# Altium schematic sheet Sheet2.SchDoc
size A4
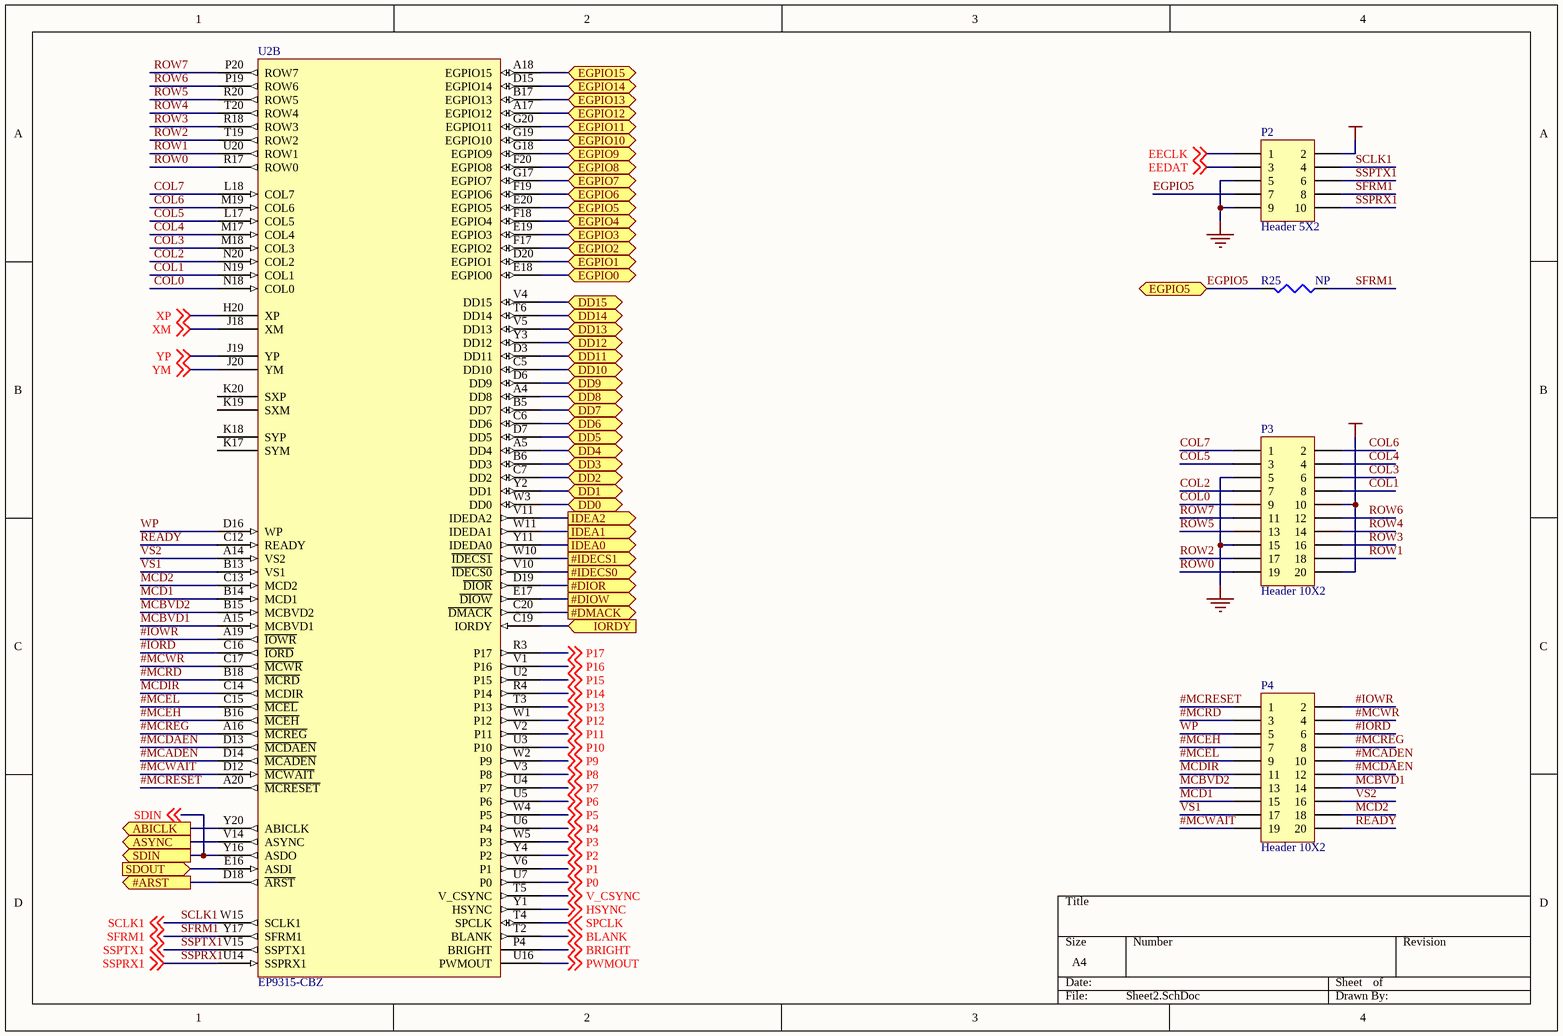
[diagram p0: Sheet2.SchDoc]

## Parts
P2  Header 5X2  [HDR2X5]
P3  Header 10X2  [HDR2X10]
P4  Header 10X2  [HDR2X10]
R25  NP  [CR1608-0603]
U2  EP9315-CBZ  [BGA352x20]  (part B of 4)

## Ports
#ARST (out), #DIOR (out), #DIOW (out), #DMACK (out), #IDECS0 (out), #IDECS1 (out), ABICLK (out), ASYNC (out), DD0 (bidir), DD1 (bidir), DD2 (bidir), DD3 (bidir), DD4 (bidir), DD5 (bidir), DD6 (bidir), DD7 (bidir), DD8 (bidir), DD9 (bidir), DD10 (bidir), DD11 (bidir), DD12 (bidir), DD13 (bidir), DD14 (bidir), DD15 (bidir), EGPIO0 (bidir), EGPIO1 (bidir), EGPIO2 (bidir), EGPIO3 (bidir), EGPIO4 (bidir), EGPIO5 (bidir), EGPIO6 (bidir), EGPIO7 (bidir), EGPIO8 (bidir), EGPIO9 (bidir), EGPIO10 (bidir), EGPIO11 (bidir), EGPIO12 (bidir), EGPIO13 (bidir), EGPIO14 (bidir), EGPIO15 (bidir), IDEA0 (out), IDEA1 (out), IDEA2 (out), IORDY (in), SDIN (out), SDOUT (in)

## Nets
GND: P2.5 P2.9 P3.5 P3.15
VCCIO: P2.2 P3.10 P3.20
#ARST: U2.D18(~{ARST}) ; port #ARST
#DIOR: U2.D19(~{DIOR}) ; port #DIOR
#DIOW: U2.E17(~{DIOW}) ; port #DIOW
#DMACK: U2.C20(~{DMACK}) ; port #DMACK
#IDECS0: U2.V10(~{IDECS0}) ; port #IDECS0
#IDECS1: U2.W10(~{IDECS1}) ; port #IDECS1
#IORD: P4.6 U2.C16(~{IORD})
#IOWR: P4.2 U2.A19(~{IOWR})
#MCADEN: P4.10 U2.D14(~{MCADEN})
#MCDAEN: P4.12 U2.D13(~{MCDAEN})
#MCEH: P4.7 U2.B16(~{MCEH})
#MCEL: P4.9 U2.C15(~{MCEL})
#MCRD: P4.3 U2.B18(~{MCRD})
#MCREG: P4.8 U2.A16(~{MCREG})
#MCRESET: P4.1 U2.A20(~{MCRESET})
#MCWAIT: P4.19 U2.D12(~{MCWAIT})
#MCWR: P4.4 U2.C17(~{MCWR})
ABICLK: U2.Y20(ABICLK) ; port ABICLK
ASYNC: U2.V14(ASYNC) ; port ASYNC
BLANK: U2.T2(BLANK) ; off-sheet BLANK
BRIGHT: U2.P4(BRIGHT) ; off-sheet BRIGHT
COL0: P3.9 U2.N18(COL0)
COL1: P3.8 U2.N19(COL1)
COL2: P3.7 U2.N20(COL2)
COL3: P3.6 U2.M18(COL3)
COL4: P3.4 U2.M17(COL4)
COL5: P3.3 U2.L17(COL5)
COL6: P3.2 U2.M19(COL6)
COL7: P3.1 U2.L18(COL7)
DD0: U2.W3(DD0) ; port DD0
DD1: U2.Y2(DD1) ; port DD1
DD2: U2.C7(DD2) ; port DD2
DD3: U2.B6(DD3) ; port DD3
DD4: U2.A5(DD4) ; port DD4
DD5: U2.D7(DD5) ; port DD5
DD6: U2.C6(DD6) ; port DD6
DD7: U2.B5(DD7) ; port DD7
DD8: U2.A4(DD8) ; port DD8
DD9: U2.D6(DD9) ; port DD9
DD10: U2.C5(DD10) ; port DD10
DD11: U2.D3(DD11) ; port DD11
DD12: U2.Y3(DD12) ; port DD12
DD13: U2.V5(DD13) ; port DD13
DD14: U2.T6(DD14) ; port DD14
DD15: U2.V4(DD15) ; port DD15
EECLK: P2.1 ; off-sheet EECLK
EEDAT: P2.3 ; off-sheet EEDAT
EGPIO0: U2.E18(EGPIO0) ; port EGPIO0
EGPIO1: U2.D20(EGPIO1) ; port EGPIO1
EGPIO2: U2.F17(EGPIO2) ; port EGPIO2
EGPIO3: U2.E19(EGPIO3) ; port EGPIO3
EGPIO4: U2.F18(EGPIO4) ; port EGPIO4
EGPIO5: P2.7 R25.2 U2.E20(EGPIO5) ; port EGPIO5
EGPIO6: U2.F19(EGPIO6) ; port EGPIO6
EGPIO7: U2.G17(EGPIO7) ; port EGPIO7
EGPIO8: U2.F20(EGPIO8) ; port EGPIO8
EGPIO9: U2.G18(EGPIO9) ; port EGPIO9
EGPIO10: U2.G19(EGPIO10) ; port EGPIO10
EGPIO11: U2.G20(EGPIO11) ; port EGPIO11
EGPIO12: U2.A17(EGPIO12) ; port EGPIO12
EGPIO13: U2.B17(EGPIO13) ; port EGPIO13
EGPIO14: U2.D15(EGPIO14) ; port EGPIO14
EGPIO15: U2.A18(EGPIO15) ; port EGPIO15
HSYNC: U2.Y1(HSYNC) ; off-sheet HSYNC
IDEA0: U2.Y11(IDEDA0) ; port IDEA0
IDEA1: U2.W11(IDEDA1) ; port IDEA1
IDEA2: U2.V11(IDEDA2) ; port IDEA2
IORDY: U2.C19(IORDY) ; port IORDY
MCBVD1: P4.14 U2.A15(MCBVD1)
MCBVD2: P4.13 U2.B15(MCBVD2)
MCD1: P4.15 U2.B14(MCD1)
MCD2: P4.18 U2.C13(MCD2)
MCDIR: P4.11 U2.C14(MCDIR)
P0: U2.U7(P0) ; off-sheet P0
P1: U2.V6(P1) ; off-sheet P1
P2: U2.Y4(P2) ; off-sheet P2
P3: U2.W5(P3) ; off-sheet P3
P4: U2.U6(P4) ; off-sheet P4
P5: U2.W4(P5) ; off-sheet P5
P6: U2.U5(P6) ; off-sheet P6
P7: U2.U4(P7) ; off-sheet P7
P8: U2.V3(P8) ; off-sheet P8
P9: U2.W2(P9) ; off-sheet P9
P10: U2.U3(P10) ; off-sheet P10
P11: U2.V2(P11) ; off-sheet P11
P12: U2.W1(P12) ; off-sheet P12
P13: U2.T3(P13) ; off-sheet P13
P14: U2.R4(P14) ; off-sheet P14
P15: U2.U2(P15) ; off-sheet P15
P16: U2.V1(P16) ; off-sheet P16
P17: U2.R3(P17) ; off-sheet P17
PWMOUT: U2.U16(PWMOUT) ; off-sheet PWMOUT
READY: P4.20 U2.C12(READY)
ROW0: P3.19 U2.R17(ROW0)
ROW1: P3.18 U2.U20(ROW1)
ROW2: P3.17 U2.T19(ROW2)
ROW3: P3.16 U2.R18(ROW3)
ROW4: P3.14 U2.T20(ROW4)
ROW5: P3.13 U2.R20(ROW5)
ROW6: P3.12 U2.P19(ROW6)
ROW7: P3.11 U2.P20(ROW7)
SCLK1: P2.4 U2.W15(SCLK1) ; off-sheet SCLK1
SDIN: U2.Y16(ASDO) ; off-sheet SDIN, port SDIN
SDOUT: U2.E16(ASDI) ; port SDOUT
SFRM1: P2.8 R25.1 U2.Y17(SFRM1) ; off-sheet SFRM1
SPCLK: U2.T4(SPCLK) ; off-sheet SPCLK
SSPRX1: P2.10 U2.U14(SSPRX1) ; off-sheet SSPRX1
SSPTX1: P2.6 U2.V15(SSPTX1) ; off-sheet SSPTX1
V_CSYNC: U2.T5(V_CSYNC) ; off-sheet V_CSYNC
VS1: P4.17 U2.B13(VS1)
VS2: P4.16 U2.A14(VS2)
WP: P4.5 U2.D16(WP)
XM: U2.J18(XM) ; off-sheet XM
XP: U2.H20(XP) ; off-sheet XP
YM: U2.J20(YM) ; off-sheet YM
YP: U2.J19(YP) ; off-sheet YP

Not connected (* = marked no-connect by the designer): U2 K17(SYM) K18(SYP) K19(SXM) K20(SXP)

## Library data of the parts
P2 = Header 5X2: Header, 5-Pin, Dual row; LatestRevisionDate: 17-Jul-2002; LatestRevisionNote: Re-released for DXP Platform.; Publisher: Altium Limited
P3 P4 = Header 10X2: Header, 10-Pin, Dual row; LatestRevisionDate: 17-Jul-2002; LatestRevisionNote: Re-released for DXP Platform.; Publisher: Altium Limited
R25 = Res3: Resistor; Published: 8-Jun-2000; Revision: July-2002: Re-released for DXP Platform.; Publisher: Altium Limited; Value: NP
U2 = EP9315-CBZ: 32 Bit ARM920T Microcontroller with inegrated graphics, IDE, PCMCIA, Ethernet